# EAGLE schematic RF_SPACER (EAGLE 9.6.2)

## Sheet 1 of 3: Board to Board Headers
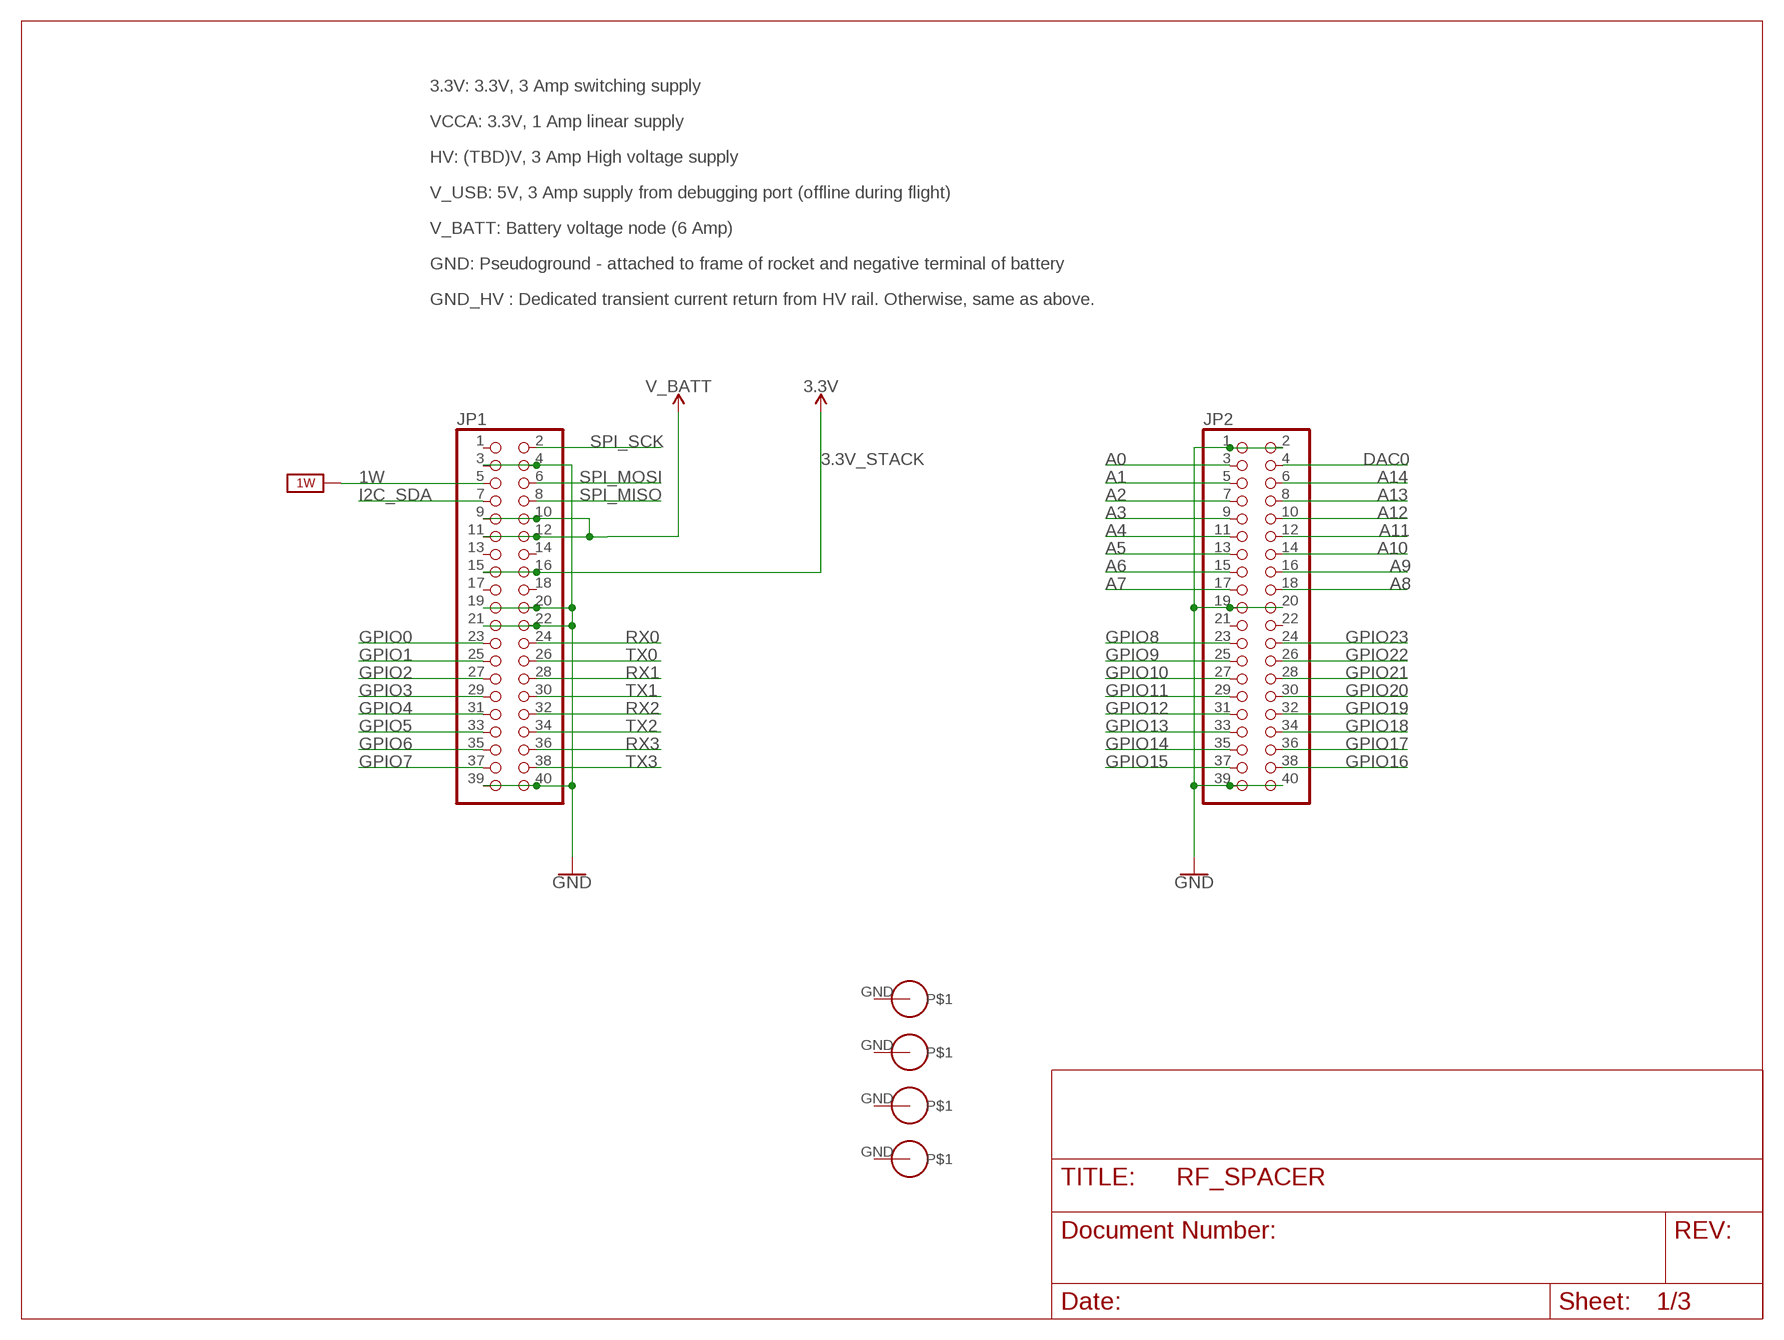
[diagram p0: schematic, sheet 1]

### Parts
JP1  PINHD-2X20  [2X20]
JP2  PINHD-2X20  [2X20]
U$1  PS/104-MOUNTING-HOLE  [PC/104-MOUNTING-HOLE]
U$2  PS/104-MOUNTING-HOLE  [PC/104-MOUNTING-HOLE]
U$3  PS/104-MOUNTING-HOLE  [PC/104-MOUNTING-HOLE]
U$4  PS/104-MOUNTING-HOLE  [PC/104-MOUNTING-HOLE]

### Nets
1W: JP1.5 ; supply symbol labelled 1W_SUP
3.3V_STACK: JP1.15 JP1.16 ; supply symbol labelled 3.3V
A0: JP2.3
A1: JP2.5
A2: JP2.7
A3: JP2.9
A4: JP2.11
A5: JP2.13
A6: JP2.15
A7: JP2.17
A8: JP2.18
A9: JP2.16
A10: JP2.14
A11: JP2.12
A12: JP2.10
A13: JP2.8
A14: JP2.6
DAC0: JP2.4
GND: JP1.3 JP1.4 JP1.19 JP1.20 JP1.21 JP1.22 JP1.39 JP1.40 JP2.1 JP2.2 JP2.19 JP2.20 JP2.39 JP2.40
GPIO0: JP1.23
GPIO1: JP1.25
GPIO2: JP1.27
GPIO3: JP1.29
GPIO4: JP1.31
GPIO5: JP1.33
GPIO6: JP1.35
GPIO7: JP1.37
GPIO8: JP2.23
GPIO9: JP2.25
GPIO10: JP2.27
GPIO11: JP2.29
GPIO12: JP2.31
GPIO13: JP2.33
GPIO14: JP2.35
GPIO15: JP2.37
GPIO16: JP2.38
GPIO17: JP2.36
GPIO18: JP2.34
GPIO19: JP2.32
GPIO20: JP2.30
GPIO21: JP2.28
GPIO22: JP2.26
GPIO23: JP2.24
I2C_SDA: JP1.7
N$4: JP1.9 JP1.10 JP1.11 JP1.12
RX0: JP1.24
RX1: JP1.28
RX2: JP1.32
RX3: JP1.36
SPI_MISO: JP1.8
SPI_MOSI: JP1.6
SPI_SCK: JP1.2
TX0: JP1.26
TX1: JP1.30
TX2: JP1.34
TX3: JP1.38
Unconnected: JP1.1 JP1.13 JP1.14 JP1.17 JP1.18 JP2.21 JP2.22 U$1.GND U$2.GND U$3.GND U$4.GND

### Notes on the sheet
- 3.3V: 3.3V, 3 Amp switching supply
- VCCA: 3.3V, 1 Amp linear supply
- HV: (TBD)V, 3 Amp High voltage supply
- V_USB: 5V, 3 Amp supply from debugging port (offline during flight)
- V_BATT: Battery voltage node (6 Amp)
- GND: Pseudoground - attached to frame of rocket and negative terminal of battery
- GND_HV : Dedicated transient current return from HV rail. Otherwise, same as above.

## Sheet 2 of 3: RN2483 434MHz RF module
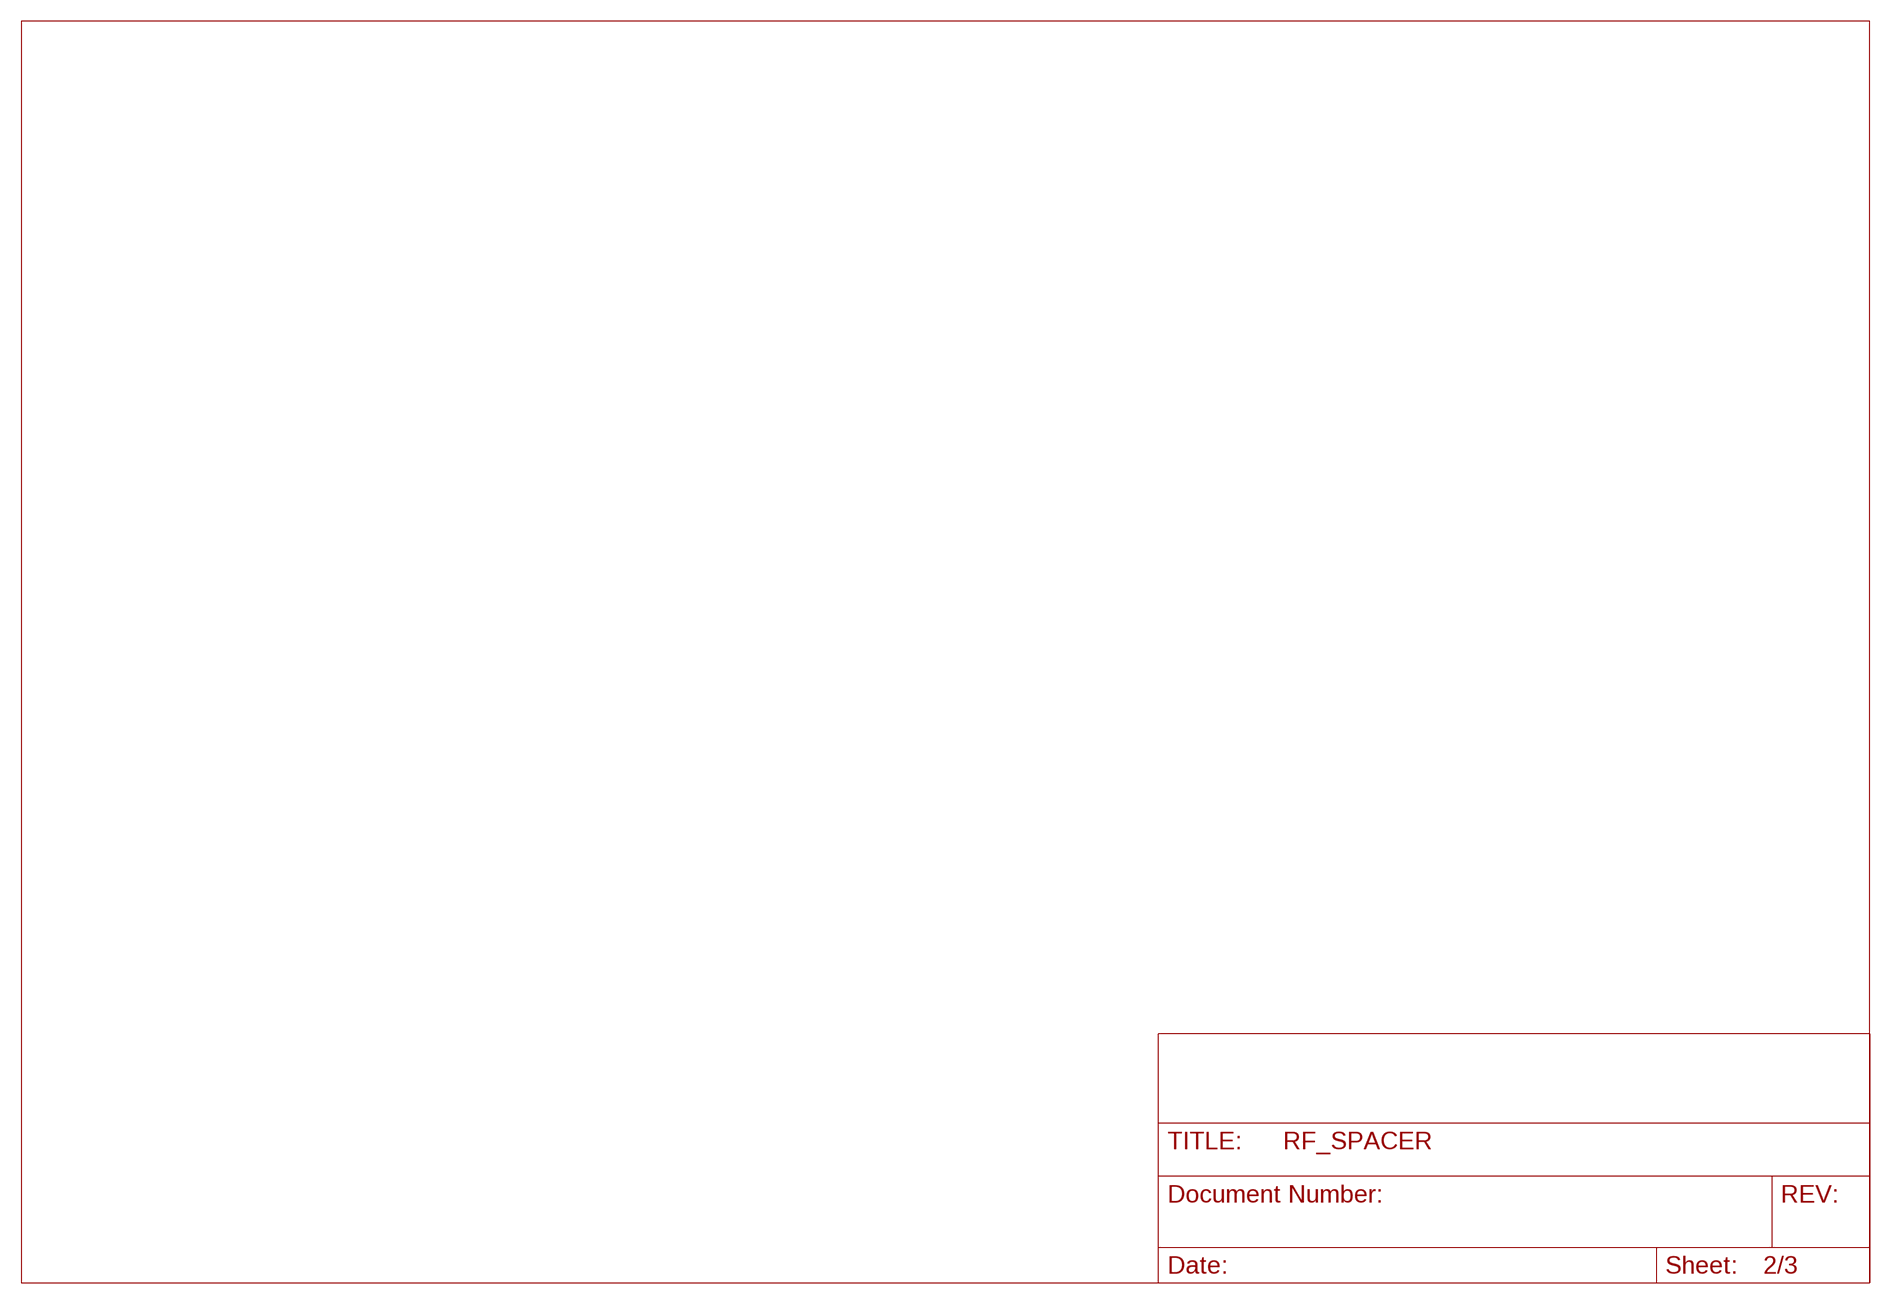
[diagram p1: schematic, sheet 2]

## Sheet 3 of 3: RN2903 903MHz RF module

## Library data of the parts
JP1 JP2 = pinhead:PINHD-2X20: PIN HEADER
U$1-U$4 = CU inSpace 2019 Parts:PS/104-MOUNTING-HOLE: Mounting hole for PC/104 board.